# EAGLE schematic RFID_reader_v2 (EAGLE 9.0.1)
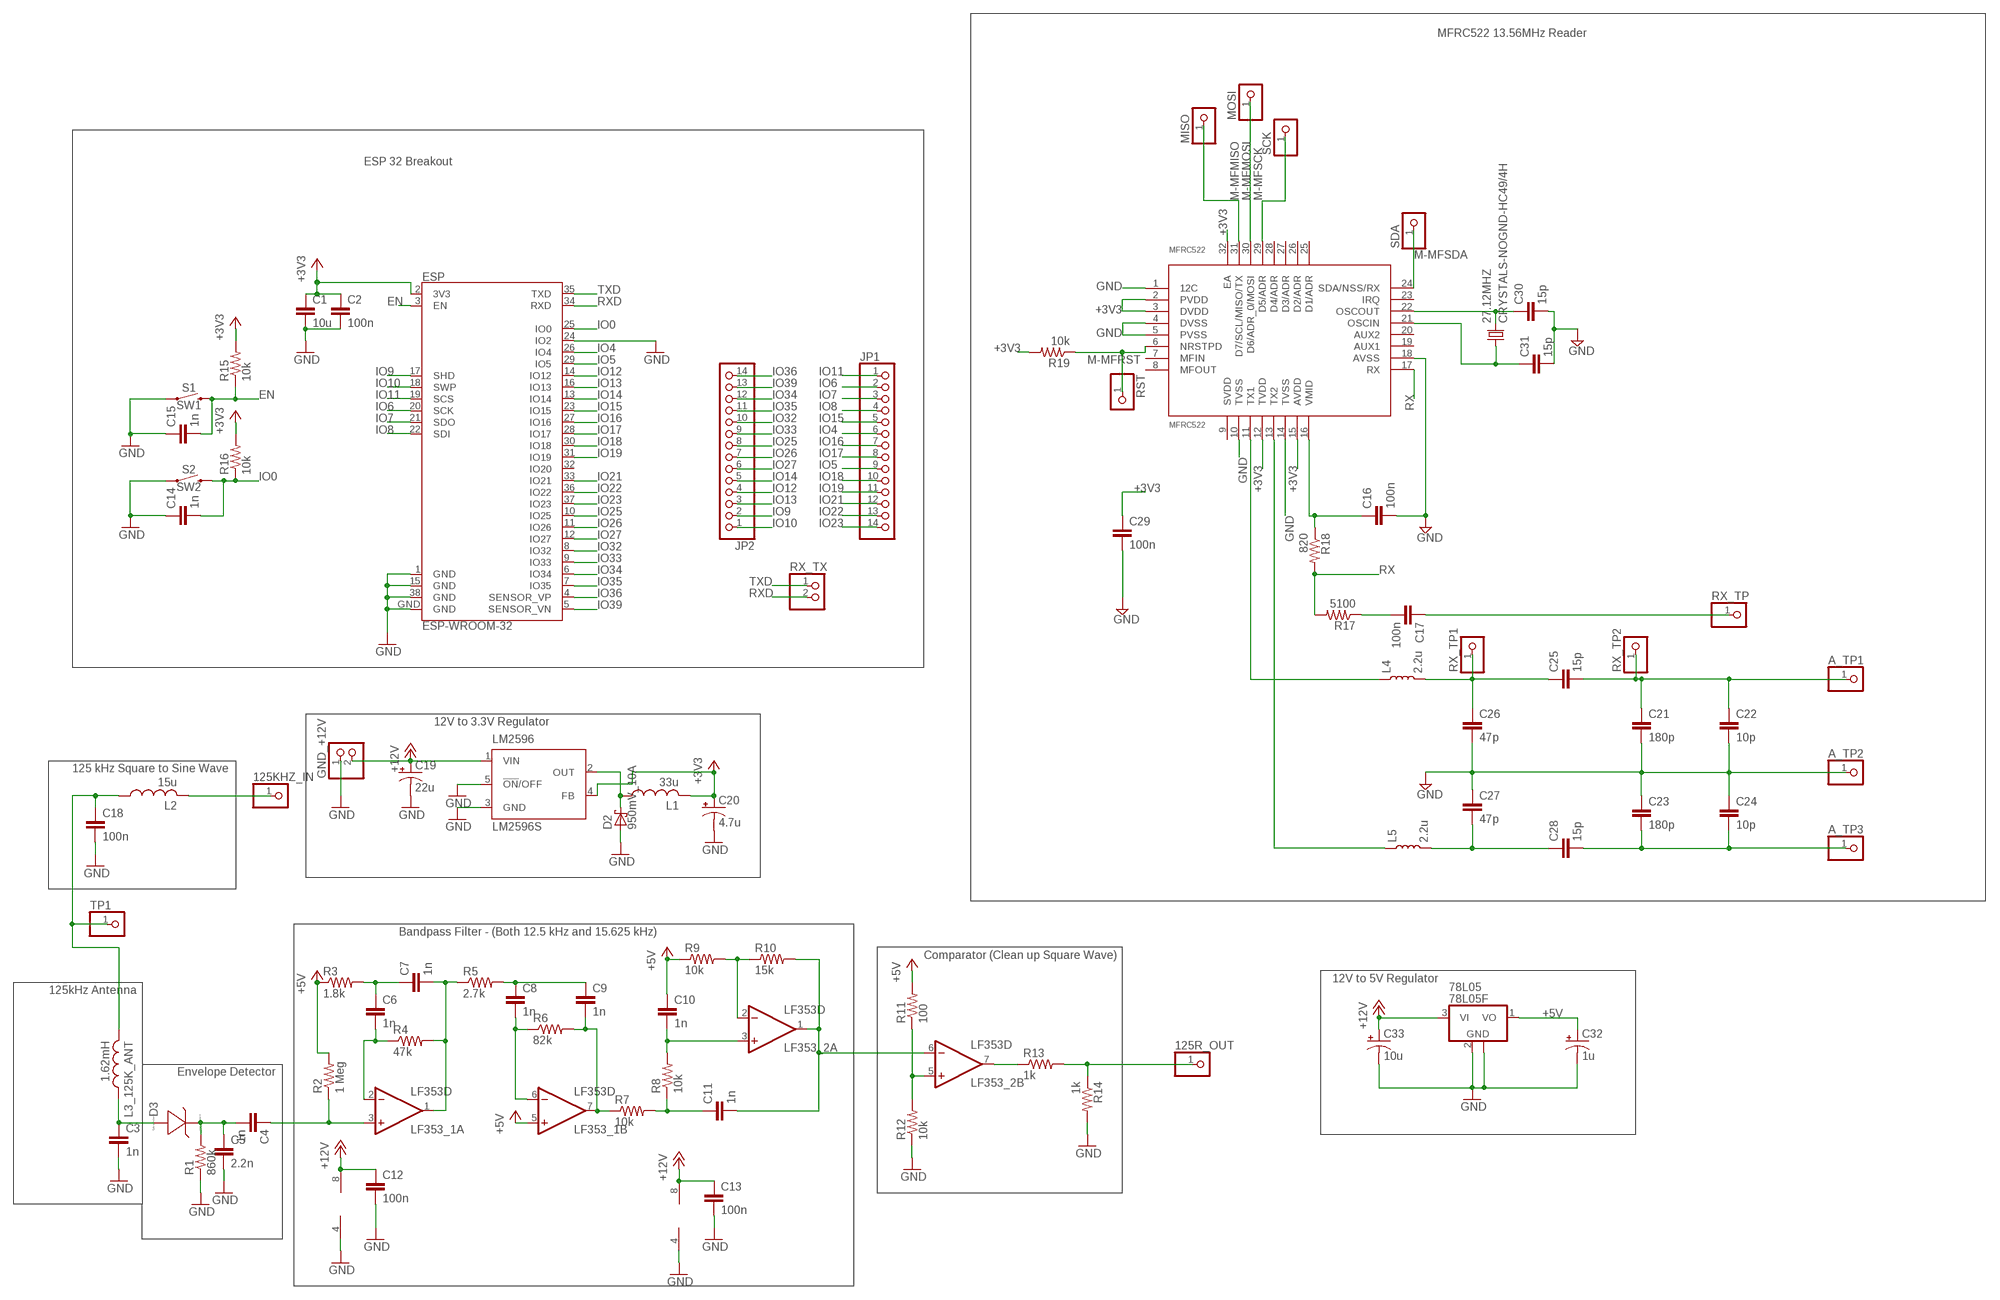
[diagram p0: schematic, sheet 1]

## Parts
27.12MHZ  CRYSTALS-NOGND-HC49/4H  [HC49]
78L05  78L05F  [SOT89]
125KHZ_IN  PINHD-1X1  [1X01]
125R_OUT  PINHD-1X1  [1X01]
A_TP1  PINHD-1X1  [1X01]
A_TP2  PINHD-1X1  [1X01]
A_TP3  PINHD-1X1  [1X01]
C1  10u  C-EUC0805  [C0805]
C2  100n  C-EUC0805  [C0805]
C3  1n  C-EUC0805  [C0805]
C4  1n  C-EUC0805  [C0805]
C5  2.2n  C-EUC0805  [C0805]
C6  1n  C-EUC0805  [C0805]
C7  1n  C-EUC0805  [C0805]
C8  1n  C-EUC0805  [C0805]
C9  1n  C-EUC0805  [C0805]
C10  1n  C-EUC0805  [C0805]
C11  1n  C-EUC0805  [C0805]
C12  100n  C-EUC0805  [C0805]
C13  100n  C-EUC0805  [C0805]
C14  1n  C-EUC0805  [C0805]
C15  1n  C-EUC0805  [C0805]
C16  100n  C-EUC0603  [C0603]
C17  100n  C-EUC0603  [C0603]
C18  100n  C-EUC0805  [C0805]
C19  22u  CPOL-USSANYO_SMD_B6  [SANYO-OSCON_SMD_B6]
C20  4.7u  CPOL-USSMCC  [SMC_C]
C21  180p  C-EUC0603  [C0603]
C22  10p  C-EUC0603  [C0603]
C23  180p  C-EUC0603  [C0603]
C24  10p  C-EUC0603  [C0603]
C25  15p  C-EUC0603  [C0603]
C26  47p  C-EUC0603  [C0603]
C27  47p  C-EUC0603  [C0603]
C28  15p  C-EUC0603  [C0603]
C29  100n  C-EUC0603  [C0603]
C30  15p  C-EUC0603  [C0603]
C31  15p  C-EUC0603  [C0603]
C32  1u  CPOL-USSMCA  [SMC_A]
C33  10u  CPOL-USSMCC  [SMC_C]
D2  950mV_10A  SCHOTTKY-DIODESMC  [SMC]
D3  ZENER  [SOD123]
ESP  ESP-WROOM-32  [ESP-WROOM-32]
GND_+12V  PINHD-1X2  [1X02]
JP1  PINHD-1X14  [1X14]
JP2  PINHD-1X14  [1X14]
L1  33u  L-US0207/10  [0207/10]
L2  15u  L-USL2012C  [L2012C]
L3_125K_ANT  1.62mH  L-US0207/10  [0207/10]
L4  2.2u  INDUCTOR-0603-33NH  [0603]
L5  2.2u  INDUCTOR-0603-33NH  [0603]
LF353_1  LF353D  [SO08]
LF353_2  LF353D  [SO08]
LM2596  LM2596S  [TO263-5]
MFRC522  MFRC522  [MFR522]
MISO  PINHD-1X1  [1X01]
MOSI  PINHD-1X1  [1X01]
R1  860k  R-US_R0805  [R0805]
R2  1 Meg  R-US_R0805  [R0805]
R3  1.8k  R-US_R0805  [R0805]
R4  47k  R-US_R0805  [R0805]
R5  2.7k  R-US_R0805  [R0805]
R6  82k  R-US_R0805  [R0805]
R7  10k  R-US_R0805  [R0805]
R8  10k  R-US_R0805  [R0805]
R9  10k  R-US_R0805  [R0805]
R10  15k  R-US_R0805  [R0805]
R11  100  R-US_R0805  [R0805]
R12  10k  R-US_R0805  [R0805]
R13  1k  R-US_R0805  [R0805]
R14  1k  R-US_R0805  [R0805]
R15  10k  R-US_R0805  [R0805]
R16  10k  R-US_R0805  [R0805]
R17  5100  R-US_R0603  [R0603]
R18  820  R-US_R0603  [R0603]
R19  10k  R-US_R0603  [R0603]
RST  PINHD-1X1  [1X01]
RX_TP  PINHD-1X1  [1X01]
RX_TP1  PINHD-1X1  [1X01]
RX_TP2  PINHD-1X1  [1X01]
RX_TX  PINHD-1X2  [1X02]
S1  SW1  MOMENTARY-SWITCH-SPST-SMD-6.0X3.5MM  [TACTILE_SWITCH_SMD_6.0X3.5MM]
S2  SW2  MOMENTARY-SWITCH-SPST-SMD-6.0X3.5MM  [TACTILE_SWITCH_SMD_6.0X3.5MM]
SCK  PINHD-1X1  [1X01]
SDA  PINHD-1X1  [1X01]
TP1  PINHD-1X1  [1X01]

## Nets
+3V3: C1.1 C2.1 C20.+ C29.1 ESP.2(3V3) L1.2 LM2596.4(FB) MFRC522.2(PVDD) MFRC522.3(DVDD) MFRC522.12(TVDD) MFRC522.15(AVDD) MFRC522.32(EA) R15.2 R16.2 R19.2
+5V: 78L05.1(VO) C10.1 C32.+ LF353_1.5(B:+IN) R2.2 R3.1 R9.1 R11.2
+12V: 78L05.3(VI) C12.1 C13.1 C19.+ C33.+ GND_+12V.2 LF353_1.8(P:V+) LF353_2.8(P:V+) LM2596.1(VIN)
EN: C15.2 ESP.3(EN) R15.1 S1.2
GND: 78L05.2(GND) 78L05.2@1(GND) A_TP2.1 C1.2 C2.2 C3.2 C5.2 C12.2 C13.2 C14.1 C15.1 C16.2 C18.2 C19.- C20.- C21.2 C22.2 C23.1 C24.1 C26.2 C27.1 C29.2 C30.2 C31.2 C32.- C33.- D2.A ESP.1(GND) ESP.15(GND) ESP.24(IO2) ESP.38(GND) ESP.GND GND_+12V.1 LF353_1.4(P:V-) LF353_2.4(P:V-) LM2596.3(GND) LM2596.5(!ON!/OFF) MFRC522.1(12C) MFRC522.4(DVSS) MFRC522.5(PVSS) MFRC522.10(TVSS) MFRC522.14(TVSS) MFRC522.18(AVSS) R1.1 R12.1 R14.2 S1.1 S2.1
IO0: C14.2 ESP.25(IO0) R16.1 S2.2
IO4: ESP.26(IO4) JP1.6
IO5: ESP.29(IO5) JP1.9
IO6: ESP.20(SCK) JP1.2
IO7: ESP.21(SDO) JP1.3
IO8: ESP.22(SDI) JP1.4
IO9: ESP.17(SHD) JP2.2
IO10: ESP.18(SWP) JP2.1
IO11: ESP.19(SCS) JP1.1
IO12: ESP.14(IO12) JP2.4
IO13: ESP.16(IO13) JP2.3
IO14: ESP.13(IO14) JP2.5
IO15: ESP.23(IO15) JP1.5
IO16: ESP.27(IO16) JP1.7
IO17: ESP.28(IO17) JP1.8
IO18: ESP.30(IO18) JP1.10
IO19: ESP.31(IO19) JP1.11
IO21: ESP.33(IO21) JP1.12
IO22: ESP.36(IO22) JP1.13
IO23: ESP.37(IO23) JP1.14
IO25: ESP.10(IO25) JP2.8
IO26: ESP.11(IO26) JP2.7
IO27: ESP.12(IO27) JP2.6
IO32: ESP.8(IO32) JP2.10
IO33: ESP.9(IO33) JP2.9
IO34: ESP.6(IO34) JP2.12
IO35: ESP.7(IO35) JP2.11
IO36: ESP.4(SENSOR_VP) JP2.14
IO39: ESP.5(SENSOR_VN) JP2.13
M-MFMISO: MFRC522.31(D7/SCL/MISO/TX) MISO.1
M-MFMOSI: MFRC522.30(D6/ADR_0/MOSI) MOSI.1
M-MFRST: MFRC522.6(NRSTPD) R19.1 RST.1
M-MFSCK: MFRC522.29(D5/ADR) SCK.1
M-MFSDA: MFRC522.24(SDA/NSS/RX) SDA.1
N$1: C4.2 C5.1 D3.C(-) R1.2
N$2: C4.1 LF353_1.3(A:+IN) R2.1
N$3: D2.C L1.1 LM2596.2(OUT)
N$4: C3.1 D3.A(+) L3_125K_ANT.1
N$5: 125KHZ_IN.1 L2.2
N$6: C6.1 C7.1 R3.2
N$7: C6.2 LF353_1.2(A:-IN) R4.1
N$8: C8.1 C9.1 R5.2
N$9: C7.2 LF353_1.1(A:OUT) R4.2 R5.1
N$10: C8.2 LF353_1.6(B:-IN) R6.1
N$11: C9.2 LF353_1.7(B:OUT) R6.2 R7.1
N$12: C11.1 R7.2 R8.1
N$13: C10.2 LF353_2.3(A:+IN) R8.2
N$14: C17.2 R17.1
N$15: LF353_2.2(A:-IN) R9.2 R10.1
N$16: C11.2 LF353_2.1(A:OUT) LF353_2.6(B:-IN) R10.2
N$17: C18.1 L2.1 L3_125K_ANT.2 TP1.1
N$18: LF353_2.5(B:+IN) R11.1 R12.2
N$19: LF353_2.7(B:OUT) R13.1
N$20: 125R_OUT.1 R13.2 R14.1
N$21: C27.2 C28.1 L5.2
N$22: C25.1 C26.1 L4.2 RX_TP1.1
N$23: C17.1 RX_TP.1
N$24: A_TP1.1 C21.1 C22.1 C25.2 RX_TP2.1
N$25: A_TP3.1 C23.2 C24.2 C28.2
OSCIN: 27.12MHZ.1 C31.1 MFRC522.21(OSCIN)
OSCOUT: 27.12MHZ.2 C30.1 MFRC522.22(OSCOUT)
RX: MFRC522.17(RX) R17.2 R18.2
RXD: ESP.34(RXD) RX_TX.2
TX1: L4.1 MFRC522.11(TX1)
TX2: L5.1 MFRC522.13(TX2)
TXD: ESP.35(TXD) RX_TX.1
VMID: C16.1 MFRC522.16(VMID) R18.1
Unconnected: ESP.32(IO20) MFRC522.7(MFIN) MFRC522.8(MFOUT) MFRC522.9(SVDD) MFRC522.19(AUX1) MFRC522.20(AUX2) MFRC522.23(IRQ) MFRC522.25(D1/ADR) MFRC522.26(D2/ADR) MFRC522.27(D3/ADR) MFRC522.28(D4/ADR)

## Notes on the sheet
- MFRC522 13.56MHz Reader
- ESP 32 Breakout
- 12V to 3.3V Regulator
- 125 kHz Square to Sine Wave
- Bandpass Filter - (Both 12.5 kHz and 15.625 kHz)
- Comparator (Clean up Square Wave)
- 12V to 5V Regulator
- 125kHz Antenna
- Envelope Detector

## Library data of the parts
27.12MHZ = IQD-Frequency-Products:CRYSTALS-NOGND: CRYSTALS CAN NOT GROUNDED
78L05 = linear:78L*: POSITOIV-VOLTAGE REGULATORS Output up to 100 mA Source: Datasheet <http://focus.ti.com/lit/ds/symlink/ua78l05.pdf>
125KHZ_IN 125R_OUT A_TP1-A_TP3 MISO MOSI RST RX_TP RX_TP1 RX_TP2 SCK SDA TP1 = pinhead:PINHD-1X1: PIN HEADER
C1-C18 C21-C31 = rcl:C-EU: CAPACITOR, European symbol; SPICEPREFIX: C
C19 C20 C32 C33 = rcl:CPOL-US: POLARIZED CAPACITOR, American symbol; SPICEPREFIX: C
D2 = diode:SCHOTTKY-DIODE: Schottky Diode
D3 = sym:ZENER: Zener Diode
ESP = SparkFun-RF:ESP-WROOM-32; PROD_ID: IC-13849
GND_+12V RX_TX = pinhead:PINHD-1X2: PIN HEADER
JP1 JP2 = pinhead:PINHD-1X14: PIN HEADER
L1 L2 L3_125K_ANT = rcl:L-US: INDUCTOR, American symbol; SPICEPREFIX: L
L4 L5 = SparkFun-Coils:INDUCTOR: Inductors Resist changes in electrical current. Basically a coil of wire. SparkFun Products: SparkFun Load Cell Amplifier - HX711 <https://www.sparkfun.com/products/13879> IOIO-OTG - V2.2 <https://www.sparkfun.com/products/13613>; PROD_ID: NDUC-07874; VALUE: 33nH/±5%/500mA
LF353_1 = linear:LF353: OP AMP; SPICEPREFIX: J
LF353_2 = linear:LF353: OP AMP
LM2596 = national-semiconductor:LM2596: SIMPLE SWITCHER® Power Converter 150 kHz 3A Step-Down Voltage Regulator Source: http://www.national.com/ds/LM/LM2596.pdf; MF: NATIONAL SEMICONDUCTOR; MPN: LM2596S-ADJ/NOPB; OC_FARNELL: 9494367; OC_NEWARK: 41K3842
MFRC522 = mfrc:MFRC522
R1-R19 = rcl:R-US_: RESISTOR, American symbol; SPICEPREFIX: R
S1 S2 = SparkFun-Switches:MOMENTARY-SWITCH-SPST: Momentary Switch (Pushbutton) - SPST Normally-open (NO) SPST momentary switches (buttons, pushbuttons). Variants PTH-12MM - 12mm square, through-hole Momentary Pushbutton Switch - 12mm Square <https://www.sparkfun.com/products/9190> (COM-09190) PTH-6.0MM, PTH-6.0MM-KIT - 6.0mm square, through-hole Mini Pushbutton Switch <https://www.sparkfun.com/products/97> (COM-00097) KIT package intended for soldering kit's - only one side of pads' copper is exposed. PTH-RIGHT-ANGLE-KIT - Right-angle, through-hole Right Angle Tactile Button <https://www.sparkfun.com/products/10791> - Used on SparkFun BigTime Watch Kit <https://www.sparkfun.com/products/11734> SMD-12MM - 12mm square, surface-mount Tactile Button - SMD (12mm) <https://www.sparkfun.com/products/12993> (COM-12993) Used on SparkFun PicoBoard <https://www.sparkfun.com/products/11888> SMD-4.5MM - 4.5mm Square Trackball Switch Used on SparkFun Blackberry Trackballer Breakout <https://www.sparkfun.com/products/13169> SMD-4.6MMX2.8MM - 4.60mm x 2.80mm, surface mount Used on SparkFun SAMD21 Mini Breakout <https://www.sparkfun.com/products/13664> SMD-5.2MM, SMD-5.2-REDUNDANT - 5.2mm square, surface-mount Mini Pushbutton Switch - SMD <https://www.sparkfun.com/products/8720> (COM-08720) Used on Arduino Pro Mini <https://www.sparkfun.com/products/11114> REDUNDANT package connects both switch circuits together SMD-6.0X3.5MM - 6.0 x 3.5mm, surface mount Momentary Reset Switch SMD <https://www.sparkfun.com/products/8229> (COM-08229) SMD-6.2MM-TALL - 6.2mm square, surface mount Tactile Button - SMD (6mm) <https://www.sparkfun.com/products/12992> Used on SparkFun Digital Sandbox <https://www.sparkfun.com/products/12651> SMD-RIGHT-ANGLE - Right-angle, surface mount Used on SparkFun Block for Intel® Edison - Arduino <https://www.sparkfun.com/products/13036>; PROD_ID: SWCH-00815; SF_SKU: COM-08229